# EAGLE design maplebacon (EAGLE 5.11)
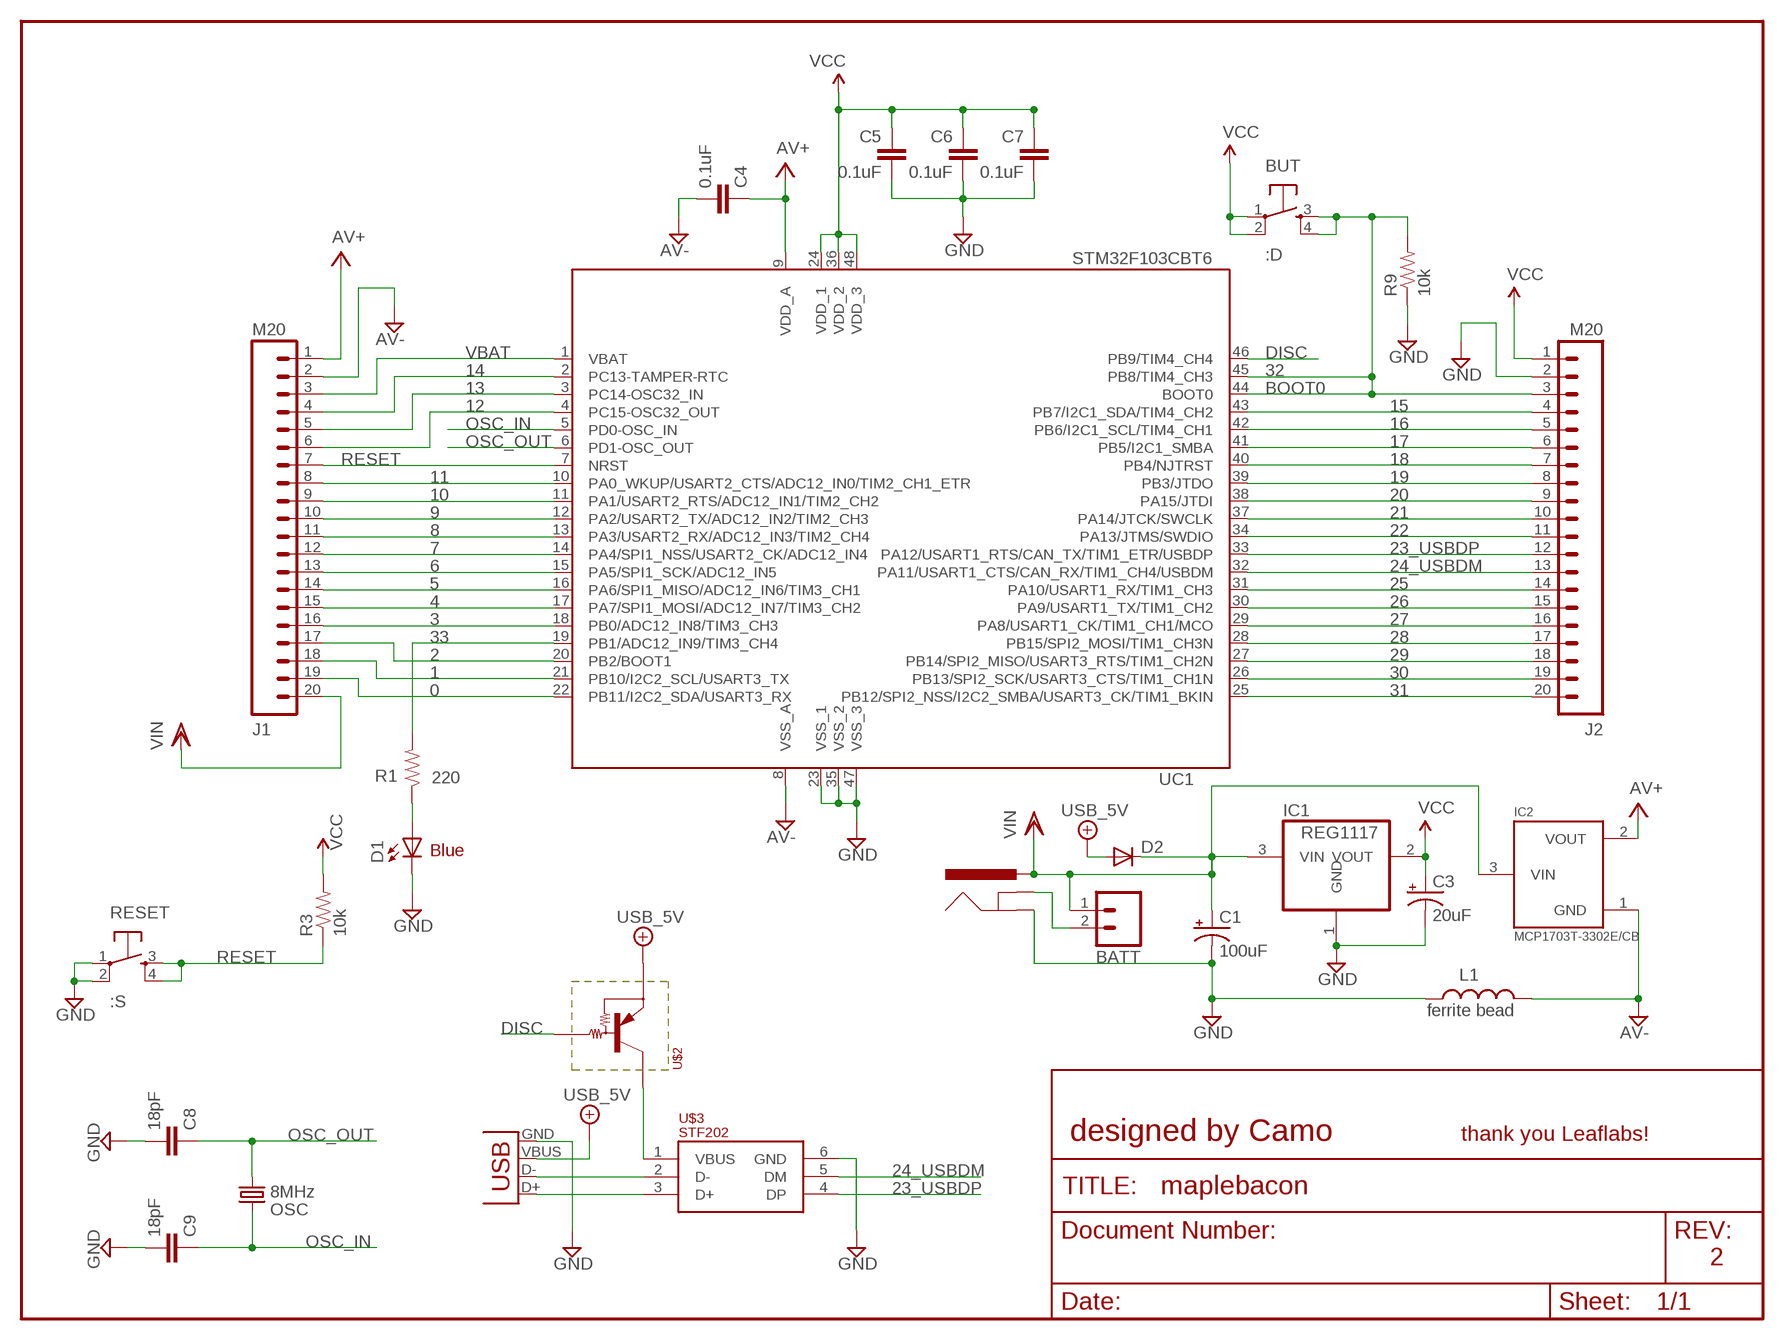
[diagram p0: schematic, sheet 1]

## Parts
BATT  M02  [02P]
BUT  :D  TAC_SWITCHPTH  [TACTILE-PTH]
C1  100uF  CAP_POLPTH2  [CPOL-RADIAL-10UF-25V]
C3  20uF  CAP_POLPTH2  [CPOL-RADIAL-10UF-25V]
C4  0.1uF  CAP0603  [0603]
C5  0.1uF  CAP0603  [0603]
C6  0.1uF  CAP0603  [0603]
C7  0.1uF  CAP0603  [0603]
C8  18pF  CAP0603  [0603]
C9  18pF  CAP0603  [0603]
D1  Blue  LED3MM  [LED3MM]
D2  DIODE1N4148  [DIODE-1N4148]
IC1  REG1117  [SOT223]
IC2  MCP1703T-3302E/CB  MCP1700T  [SOT23]
J1  M20  [1X20]
J2  M20  [1X20]
J3  POWER_JACKPTH  [POWER_JACK_PTH]
L1  ferrite bead  INDUCTOR0603  [0603]
OSC  8MHz  CRYSTALSMD  [HC49UP]
R1  220  RESISTOR0603  [0603]
R3  10k  RESISTOR0603  [0603]
R9  10k  RESISTOR0603  [0603]
RESET  :S  TAC_SWITCHPTH  [TACTILE-PTH]
U$2  PDTA114E  [SOT23]
U$3  STF202  [SOT23-6L]
UC1  STM32F103CBT6  STM32F103CB  [LQFP48]
USB-B  USB-MINIB  USBPTH  [USB-B-PTH]

## Nets
0: J1.19 UC1.22(PB11/I2C2_SDA/USART3_RX)
1: J1.18 UC1.21(PB10/I2C2_SCL/USART3_TX)
2: J1.17 UC1.20(PB2/BOOT1)
3: J1.16 UC1.18(PB0/ADC12_IN8/TIM3_CH3)
4: J1.15 UC1.17(PA7/SPI1_MOSI/ADC12_IN7/TIM3_CH2)
5: J1.14 UC1.16(PA6/SPI1_MISO/ADC12_IN6/TIM3_CH1)
6: J1.13 UC1.15(PA5/SPI1_SCK/ADC12_IN5)
7: J1.12 UC1.14(PA4/SPI1_NSS/USART2_CK/ADC12_IN4)
8: J1.11 UC1.13(PA3/USART2_RX/ADC12_IN3/TIM2_CH4)
9: J1.10 UC1.12(PA2/USART2_TX/ADC12_IN2/TIM2_CH3)
10: J1.9 UC1.11(PA1/USART2_RTS/ADC12_IN1/TIM2_CH2)
11: J1.8 UC1.10(PA0_WKUP/USART2_CTS/ADC12_IN0/TIM2_CH1_ETR)
12: J1.6 UC1.4(PC15-OSC32_OUT)
13: J1.5 UC1.3(PC14-OSC32_IN)
14: J1.4 UC1.2(PC13-TAMPER-RTC)
15: J2.4 UC1.43(PB7/I2C1_SDA/TIM4_CH2)
16: J2.5 UC1.42(PB6/I2C1_SCL/TIM4_CH1)
17: J2.6 UC1.41(PB5/I2C1_SMBA)
18: J2.7 UC1.40(PB4/NJTRST)
19: J2.8 UC1.39(PB3/JTDO)
20: J2.9 UC1.38(PA15/JTDI)
21: J2.10 UC1.37(PA14/JTCK/SWCLK)
22: J2.11 UC1.34(PA13/JTMS/SWDIO)
23_USBDP: J2.12 U$3.4(DP) UC1.33(PA12/USART1_RTS/CAN_TX/TIM1_ETR/USBDP)
24_USBDM: J2.13 U$3.5(DM) UC1.32(PA11/USART1_CTS/CAN_RX/TIM1_CH4/USBDM)
25: J2.14 UC1.31(PA10/USART1_RX/TIM1_CH3)
26: J2.15 UC1.30(PA9/USART1_TX/TIM1_CH2)
27: J2.16 UC1.29(PA8/USART1_CK/TIM1_CH1/MCO)
28: J2.17 UC1.28(PB15/SPI2_MOSI/TIM1_CH3N)
29: J2.18 UC1.27(PB14/SPI2_MISO/USART3_RTS/TIM1_CH2N)
30: J2.19 UC1.26(PB13/SPI2_SCK/USART3_CTS/TIM1_CH1N)
31: J2.20 UC1.25(PB12/SPI2_NSS/I2C2_SMBA/USART3_CK/TIM1_BKIN)
32: BUT.3 BUT.4 J2.3 R9.2 UC1.44(BOOT0) UC1.45(PB8/TIM4_CH3)
33: R1.2 UC1.19(PB1/ADC12_IN9/TIM3_CH4)
+5V/2: D2.A U$2.2(C) USB-B.VBUS ; supply symbol labelled USB_5V
AV+: C4.1 IC2.2(VOUT) J1.1 UC1.9(VDD_A)
AV-: C4.2 IC2.1(GND) J1.2 L1.1 UC1.8(VSS_A)
DGND: C1.2(-) C3.2(-) C5.2 C6.2 C7.2 C8.2 C9.2 D1.K(C) IC1.1(GND) J2.2 J3.GND L1.2 R9.1 RESET.1 RESET.2 U$3.6(GND) UC1.23(VSS_1) UC1.35(VSS_2) UC1.47(VSS_3) USB-B.GND ; supply symbol labelled GND
DISC: U$2.1(B) UC1.46(PB9/TIM4_CH4)
N$1: BATT.2 J3.GNDBREAK
N$2: D1.A R1.1
N$5: U$2.3(E) U$3.1(VBUS)
N$59: U$3.2(D-) USB-B.D-
N$60: U$3.3(D+) USB-B.D+
OSC_IN: C9.1 OSC.2 UC1.5(PD0-OSC_IN)
OSC_OUT: C8.1 OSC.1 UC1.6(PD1-OSC_OUT)
RESET: J1.7 R3.1 RESET.3 RESET.4 UC1.7(NRST)
VBAT: J1.3 UC1.1(VBAT)
VCC: BUT.1 BUT.2 C3.1(+) C5.1 C6.1 C7.1 IC1.2(VOUT) J2.1 R3.2 UC1.24(VDD_1) UC1.36(VDD_2) UC1.48(VDD_3)
VIN: BATT.1 C1.1(+) D2.C IC1.3(VIN) IC2.3(VIN) J1.20 J3.PWR

## Notes on the sheet
- BOOT0
- Blue
- designed by Camo | thank you Leaflabs!
- 2

## Library data of the parts
BATT = con-amp-quick:M02: AMP QUICK CONNECTOR; OC_FARNELL: unknown; OC_NEWARK: unknown
BUT RESET = 3d2011:TAC_SWITCH: Momentary Switch Button commonly used for reset or general input. Spark Fun Electronics SKU : COM-00097
C1 C3 = SparkFun3:CAP_POL: Capacitor Polarized These are standard SMD and PTH capacitors. Normally 10uF, 47uF, and 100uF in electrolytic and tantalum varieties. Always verify the external diameter of the through hole cap, it varies with capacity, voltage, and manufacturer. The EIA devices should be standard.
C4-C9 = SparkFun:CAP: Capacitor Standard 0603 ceramic capacitor, and 0.1" leaded capacitor.
D1 = SparkFun:LED: LEDs Standard schematic elements and footprints for 5mm, 3mm, 1206, and 0603 sized LEDs. 5mm - Spark Fun Electronics SKU : COM-00529 (and others)
D2 = SparkFun3:DIODE: Diode These are standard reverse protection diodes and small signal diodes. SMA package can handle up to about 1A. SOD-323 can handle about 200mA. What the SOD-323 package when ordering, there are some mfgs out there that are 5-pin packages.
IC1 = burr-brown:REG1117: 800mA and 1A Low Dropout (LDO) Positive Regulator 1.8V, 2.5V, 2.85V, 3.3V, 5V, and Adj; MPN: REG1117; OC_FARNELL: 1097566; OC_NEWARK: 14P6981
IC2 = okie:MCP1700T
J1 J2 = SparkFun3:M20: This is just like the LOCK variant in that the holes are staggared by 5 mil, but except for the last two holes. They are not altered from the "standard" footprint layout. This is used for a special purpose on the layout of our Graphic LCD Backpack. Make sure you want to use this device before selecting it for you project!
J3 = 3d2011:POWER_JACK: Power Jack This is the standard 5.5mm barrel jack for power. The PTH is the most common, proven, reliable, footprint. All others are experimental. The Slot footprint only works if the mill layer is transmitted to the PCB fab house so be warned. Spark Fun Electronics SKU : PRT-00119. Mating wall wart : TOL-00298 (and others)
L1 = SparkFun3:INDUCTOR: Inductors Basic Inductor/Choke - 0603 and 1206. Footprints are not proven and vary greatly between part numbers.
OSC = SparkFun2:CRYSTAL: Crystals Various standard crystals. Proven footprints. Spark Fun Electronics SKU : COM-00534
R1 R3 R9 = SparkFun:RESISTOR: Resistor Basic schematic elements and footprints for 0603, 1206, and PTH 1/10th watt (small) resistors.
U$2 = bacon:PDTA114E: Transistor with matching resistors (pre biased). Digikey #568-8088-1-ND
U$3 = bacon:STF202: The STF202 is a combination EMI filter and line termination device with integrated TVS diodes for use on upstream USB ports. Digikey Part #STF202-22T1GOSCT-ND
UC1 = stm32:STM32F103CB
USB-B = SparkFun2:USB: USB Connectors USB-B-PTH is fully proven SKU : PRT-00139 USB-miniB is fully proven SKU : PRT-00587 USB-A-PCB is untested. USB-A-H is throughly reviewed, but untested. Spark Fun Electronics SKU : PRT-00437 USB-B-SMT is throughly reviewed, but untested. Needs silkscreen touching up. USB-A-S has not been used/tested USB-MB-H has not been used/tested

## Net classes
1 vcc: width 0.254 mm

## Board
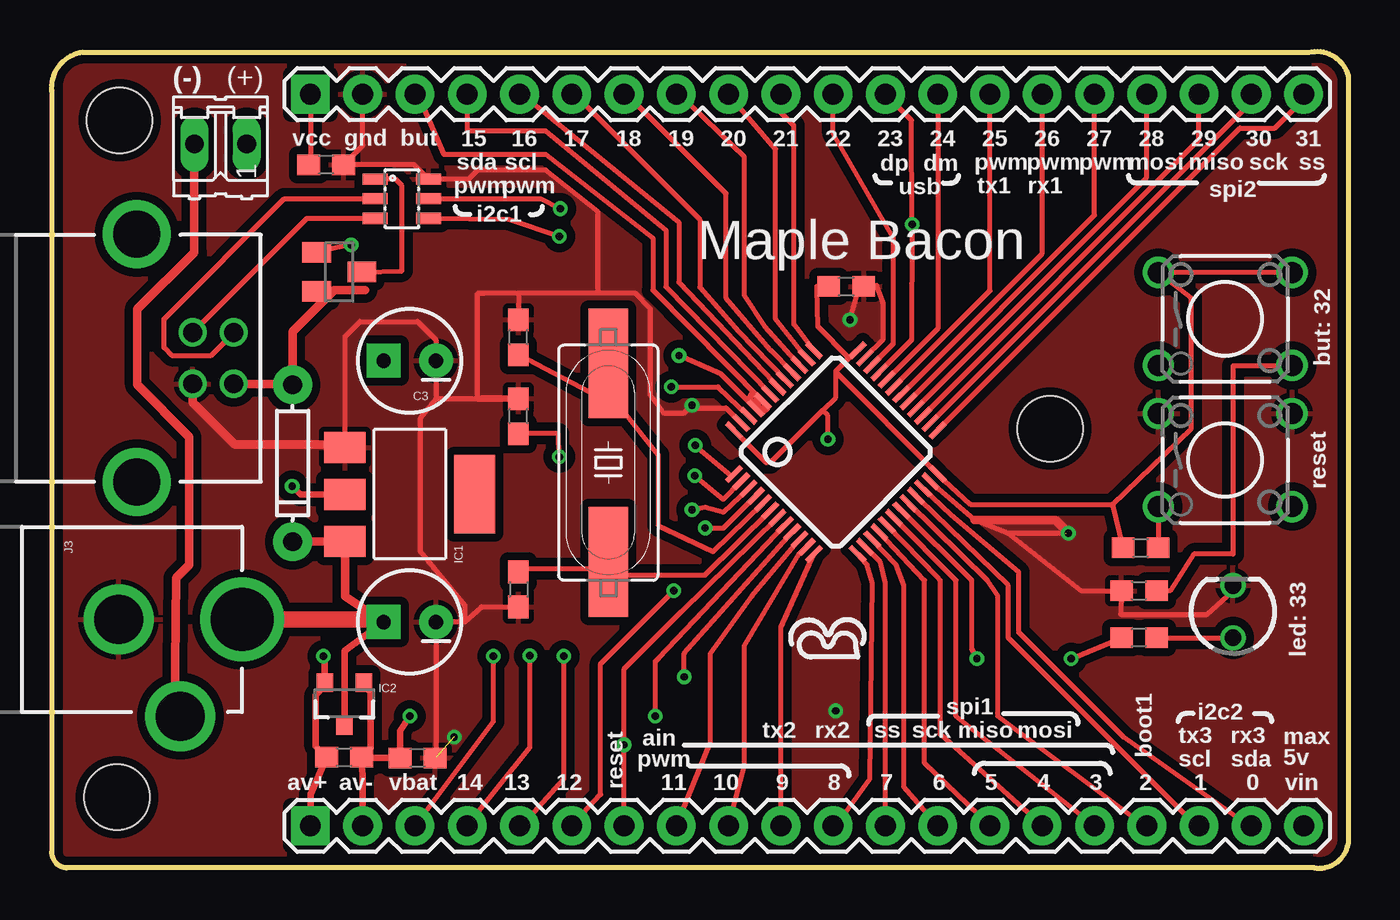
[diagram p1: board, top side]
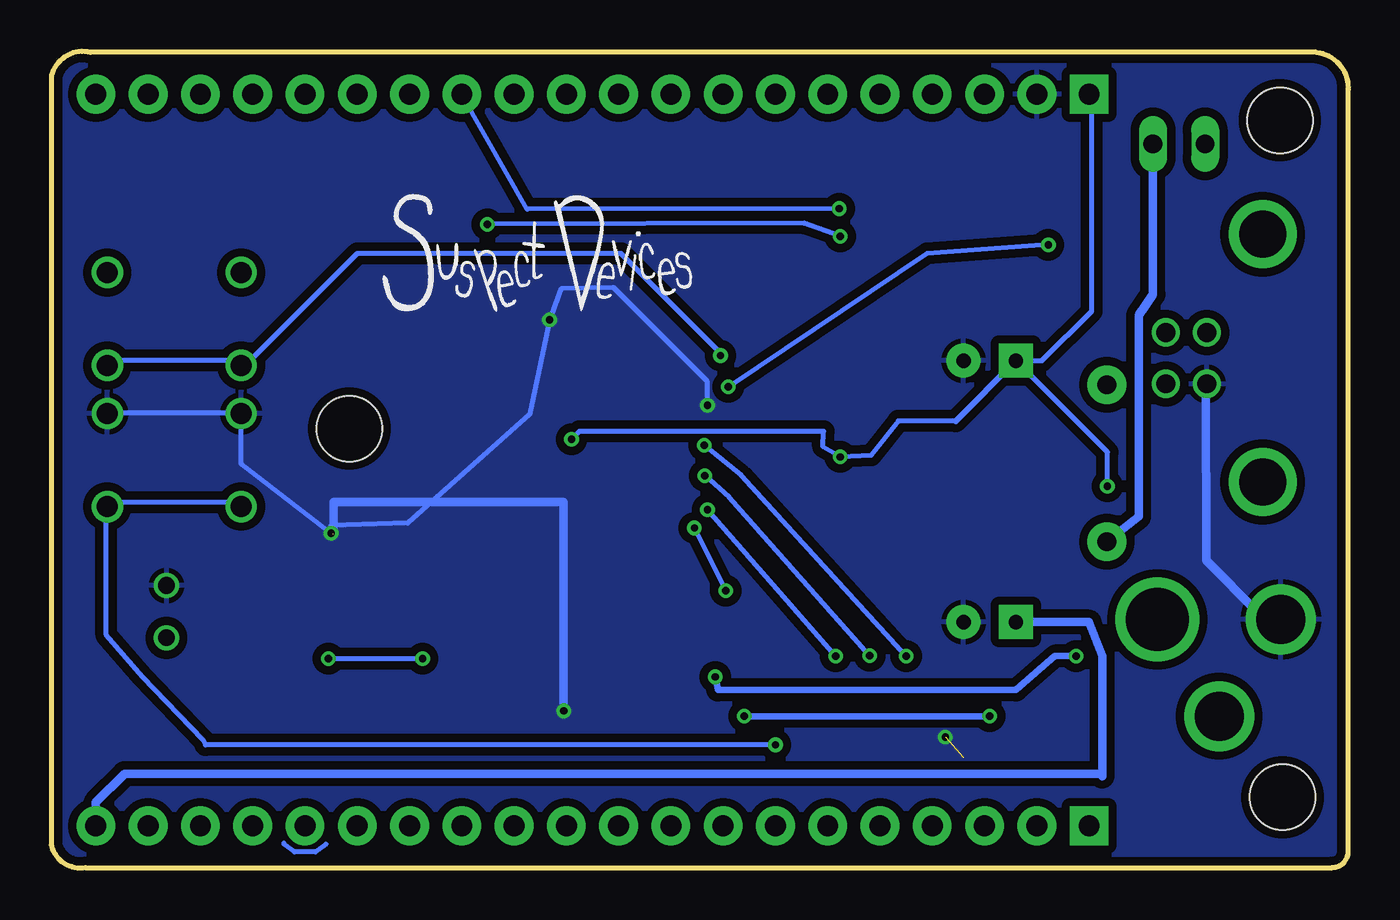
[diagram p2: board, bottom side, seen from below]

Size 63 x 39.69 mm. Coordinates in mm from the lower left corner, seen from the top.
Outline: 1.53,39.65 61.1,39.65 arc-90 63,38.5 63,1.17 arc-90 61.35,0.02 0.77,0.02 arc-90 0.01,0.78 0.01,37.74 arc-90 1.53,39.65
Copper layers (1*16): Top 0.0356mm / dielectric 1.5011mm / Bottom 0.0356mm
Design rules "LaenPCBOrder": minimum track width 6mil, minimum drill 13mil, track to track 6mil, track to pad 6mil, pad to pad 6mil, via to via 6mil, smd to smd 6mil, copper to edge 15mil, drill to drill 6mil, minimum pad ring 7mil, minimum via ring 7mil, stop-mask expansion 4mil, vias tented up to drill 0mil, thermal gap 10mil
Holes 3.17 mm at 3.31,36.34 3.19,3.45 48.52,21.36

### Footprints (pad centres in the part's own frame; a part is rotated, then mirrored left to right if it is on the bottom)
02P = drill 0.914 long: 1 -1.27,0; 2 1.27,0
TACTILE-PTH = drill 1.016 round: 1 -3.251,2.261; 2 3.251,2.261; 3 -3.251,-2.261; 4 3.251,-2.261
CPOL-RADIAL-10UF-25V = drill 0.7 pad 1.651 square: 1 1.27,0 | drill 0.7 pad 1.651 round: 2 -1.27,0
0603 = smd 1.1 x 1: 1 -0.85,0; 2 0.85,0
LED3MM = drill 0.813 round: A -1.27,0; K 1.27,0
DIODE-1N4148 = drill 0.9 pad 1.88 round: A -3.81,0; C 3.81,0
SOT223 = smd 1.499 x 2.007: 1 -2.261,-3.15; 2 0.025,-3.15; 3 2.311,-3.15 | smd 3.81 x 2.007: 4 0,3.15
SOT23 = smd 0.8 x 0.9: 1 -0.95,-1; 2 0.95,-1; 3 0,1.1
1X20 = drill 1.016 pad 1.88 square: 1 0,0 | drill 1.016 pad 1.88 round: 2 2.54,0; 3 5.08,0; 4 7.62,0; 5 10.16,0; 6 12.7,0; 7 15.24,0; 8 17.78,0; 9 20.32,0; 10 22.86,0; 11 25.4,0; 12 27.94,0; 13 30.48,0; 14 33.02,0; 15 35.56,0; 16 38.1,0; 17 40.64,0; 18 43.18,0; 19 45.72,0; 20 48.26,0
POWER_JACK_PTH = drill 2.381 round: GND 0,7.7; GNDBREAK 4.7,10.7 | drill 3.048 round: PWR 0,13.7
HC49UP = smd 5.334 x 1.93: 1 -4.826,0; 2 4.826,0
SOT23' = smd 1 x 1.4: 1 -0.95,-1.1; 2 0.95,-1.1; 3 0,1.1
SOT23-6L = smd 0.55 x 1.2: 1 -0.95,-1.3; 2 0,-1.3; 3 0.95,-1.3; 4 0.95,1.3; 5 0,1.3; 6 -0.95,1.3
LQFP48 = smd 0.254 x 1: 1 -2.75,-4.25; 2 -2.25,-4.25; 3 -1.75,-4.25; 4 -1.25,-4.25; 5 -0.75,-4.25; 6 -0.25,-4.25; 7 0.25,-4.25; 8 0.75,-4.25; 9 1.25,-4.25; 10 1.75,-4.25; 11 2.25,-4.25; 12 2.75,-4.25; 25 2.75,4.25; 26 2.25,4.25; 27 1.75,4.25; 28 1.25,4.25; 29 0.75,4.25; 30 0.25,4.25; 31 -0.25,4.25; 32 -0.75,4.25; 33 -1.25,4.25; 34 -1.75,4.25; 35 -2.25,4.25; 36 -2.75,4.25 | smd 1 x 0.254: 13 4.25,-2.75; 14 4.25,-2.25; 15 4.25,-1.75; 16 4.25,-1.25; 17 4.25,-0.75; 18 4.25,-0.25; 19 4.25,0.25; 20 4.25,0.75; 21 4.25,1.25; 22 4.25,1.75; 23 4.25,2.25; 24 4.25,2.75; 37 -4.25,2.75; 38 -4.25,2.25; 39 -4.25,1.75; 40 -4.25,1.25; 41 -4.25,0.75; 42 -4.25,0.25; 43 -4.25,-0.25; 44 -4.25,-0.75; 45 -4.25,-1.25; 46 -4.25,-1.75; 47 -4.25,-2.25; 48 -4.25,-2.75
USB-B-PTH = drill 0.914 round: D+ 0,1.25; D- 1.981,1.25; GND 0,-1.25; VBUS 1.981,-1.25 | drill 2.286 round: P$1 -2.718,-6.02; P$2 -2.718,6.02

### Placement (x,y rotation side)
BATT  8.21,35.2 180 top
BUT  57.03,26.69 0 top
C1  17.41,11.96 180 top
C3  17.41,24.66 180 top
C4  14.22,5.39 0 top
C5  22.69,21.97 90 top
C6  13.35,34.19 0 top
C7  38.62,28.27 0 top
C8  22.69,13.55 270 top
C9  22.69,25.8 90 top
D1  57.41,12.47 90 top
D2  11.72,19.68 270 top
IC1  17.41,18.18 270 top
IC2  14.23,8.02 180 top
J1  12.58,2.05 0 top
J2  12.58,37.61 0 top
J3  -4.43,12.09 270 top
L1  17.79,5.36 0 top
OSC  27.06,19.71 90 top
R1  52.84,11.2 180 top
R3  52.92,15.57 180 top
R9  52.84,13.48 0 top
RESET  57.03,19.83 0 top
U$1  [SUSDEVLOGOSM]  47,27.33 0 bottom
U$2  PDTA114E  [SOT23']  13.98,28.98 270 top
U$3  17.03,32.53 270 top
UC1  38.11,20.22 315 top
USB-B  6.87,24.79 0 top

### Tracks (layer width: path | path; a pad name or v marks a point on that pad's centre or on a via)
0
  Top 0.254: UC1.22 43.7,17.17 47,14.37 47,11.45 52.08,6.37 58.18,2.05 J1.19
1
  Top 0.254: UC1.21 42.17,17.93 46.49,13.74 46.49,11.2 55.64,2.05 J1.18
2
  Top 0.254: UC1.20 45.48,13.99 45.98,13.23 45.98,7.39 53.1,2.05 J1.17
3
  Top 0.254: J1.16 43.95,7.39 43.95,13.99 40.9,17.04 UC1.18
4
  Top 0.254: J1.15 43.19,6.5 43.19,13.99 43.06,14.12 UC1.17
5
  Top 0.254: J1.14 42.43,5.1 42.43,13.99 UC1.16
6
  Top 0.254: J1.13 41.41,3.96 41.41,13.74 41.03,14.75 UC1.15
7
  Top 0.254: J1.12 40.52,13.87 40.27,14.88 39.38,15.77 UC1.14
8
  Top 0.254: UC1.13 39.63,14.75 39.89,13.87 39.76,4.34 38.11,2.05 J1.11
9
  Top 0.254: J1.10 35.44,11.71 UC1.12
10
  Top 0.254: UC1.11 36.33,15.26 33.67,10.82 33.67,4.98 J1.9
11
  Top 0.254: UC1.10 34.05,13.23 32.01,10.44 32.01,6.12 J1.8
12  (via drill 0.36)
  Top 0.254: v31.76,16.53 32.65,16.53 UC1.4 | v30.24,13.48 26.68,9.93 26.68,3.58 J1.6
  Bottom 0.254: v30.24,13.48 v31.76,16.53
13  (via drill 0.36)
  Top 0.254: v24.9,10.31 24.9,4.34 22.87,2.05 J1.5 | v31.13,17.42 31.76,17.55 32.65,17.3 UC1.3
  Bottom 0.254: v24.9,10.31 v31.13,17.42
14  (via drill 0.36)
  Top 0.254: v31.25,19.07 32.65,17.93 UC1.2 | v23.25,10.33 23.25,5.86 J1.4
  Bottom 0.254: v31.25,19.07 30.06,18.01 v23.25,10.33
15
  Top 0.254: UC1.43 29.86,28.24 29.86,31.01 24.01,35.84 20.2,35.84 J2.4
16
  Top 0.254: UC1.42 35.06,23.64 30.49,28.47 30.49,31.39 22.87,37.61 J2.5
17
  Top 0.254: UC1.41 33.41,26.06 31.51,28.22 31.51,31.52 25.41,37.61 J2.6
18
  Top 0.254: UC1.40 34.94,25.17 32.78,27.71 32.78,32.79 27.95,37.61 J2.7
19
  Top 0.254: UC1.39 34.68,26.31 33.67,27.84 33.67,34.57 30.49,37.61 J2.8
20
  Top 0.254: UC1.38 36.59,24.91 35.19,26.69 35.19,34.95 J2.9
21
  Top 0.254: UC1.37 36.08,26.44 36.08,36.09 35.44,36.73 J2.10
22
  Top 0.254: UC1.34 40.9,25.48 40.9,30.63 37.98,35.71 J2.11
23_USBDP  (via drill 0.36)
  Top 0.254: U$3.4 22.2,31.53 v24.67,30.71 | J2.12 41.79,36.34 v41.82,31.29 41.79,25.68 UC1.33
  Bottom 0.254: v24.67,30.71 26.43,31.34 v41.82,31.29
24_USBDM  (via drill 0.36)
  Top 0.254: UC1.32 43.06,26.23 J2.13 | U$3.5 23.76,32.53 v24.72,32.05
  Bottom 0.254: v24.72,32.05 39.89,32.03 J2.13
25
  Top 0.254: UC1.31 45.6,28.06 J2.14
26
  Top 0.254: UC1.30 41.16,22.88 48.14,29.87 J2.15
27
  Top 0.254: UC1.29 50.68,31.73 J2.16
28
  Top 0.254: UC1.28 53.22,33.56 J2.17
29
  Top 0.254: UC1.27 55.76,35.39 J2.18
30
  Top 0.254: UC1.26 58.3,37.23 J2.19
31
  Top 0.254: UC1.25 57.75,35.96 59.45,35.96 60.84,37.36 J2.20
32  (via drill 0.36)
  Top 0.254: J2.3 17.79,37.61 19.06,34.69 24.01,34.69 29.22,30.63 29.22,28.09 UC1.44 34.55,22.63 34.43,22.63 34.05,23.14 33.92,22.88 34.55,22.12 34.81,22.37 34.3,22.37 UC1.45 32.52,24.03 v30.49,24.91 | R9.2 54.37,13.48 55.51,15.26 57.41,15.26 57.41,24.41 60.26,24.41 BUT.4
  Bottom 0.254: BUT.4 60.21,24.66 53.86,24.66 BUT.3 53.6,24.41 48.14,29.87 35.32,29.87 30.49,25.04 v30.49,24.91
33  (via drill 0.36)
  Top 0.254: UC1.19 44.71,13.99 44.71,10.69 v44.97,10.18 | v49.54,10.18 R1.2
  Bottom 0.254: v44.97,10.18 v49.54,10.18
+5V/2
  Top 0.254: 11.67,23.54 D2.A | 15.23,28.09 U$2.2
  Top 0.406: USB-B.VBUS 11.67,23.54 | D2.A 11.72,26.08 13.73,28.09 15.23,28.09
AV+  (via drill 0.36)
  Top 0.254: UC1.9 30.74,10.44 v30.74,9.29 | 13.28,8.85 IC2.2 | 13.28,10.24 v13.22,10.31
  Top 0.305: J1.1 12.58,3.59 C4.1 12.84,5.93 12.84,8.4 13.28,8.85 | IC2.2 13.28,10.24
  Bottom 0.305: v13.22,10.31 14.23,10.31 16.14,8.66 30.62,8.66 v30.74,9.29
AV-  (via drill 0.36)
  Top 0.254: 29.49,10.2 29.35,10.06 | 29.49,10.2 UC1.8 | 15.18,8.85 IC2.1 | 15.5,5.83 C4.2 15.11,5.36 | v29.35,7.39 29.35,10.06 29.49,10.2
  Top 0.305: J1.2 15.12,4.43 C4.2 | 15.18,8.85 15.5,8.53 15.5,5.83 | 15.11,5.36 L1.1 16.94,6.67 v17.41,7.39
  Bottom 0.305: v17.41,7.39 v29.35,7.39
DGND  (via drill 0.36)  (2 unrouted)
  Top 0.254: D1.K 57.41,13.48 56.14,12.34 51.95,12.34 R9.1 50.05,13.48 46.49,16.28 | 46.49,16.28 44.84,16.91 42.94,18.56 UC1.23 | UC1.47 32.77,22.37 31.25,22.37 v31.13,22.5 30.74,22.12 29.73,22.12 29.09,23.01 29.09,27.2 28.33,27.96 26.55,27.96 | 22.69,27.96 C9.2 | C8.2 20.89,12.7 20.08,11.96 | J2.2 15.12,35.11 C6.2 17.63,34.19 U$3.6 20.26,33.48 20.71,33.93 24.01,33.93 26.55,31.9 26.55,27.96 | v49.41,16.28 46.49,16.28 | UC1.35 39.53,24.81 40.4,25.68 40.4,27.45 40.09,28.32 | 40.09,28.32 39.71,28.01 C7.2 | 40.09,28.32 39.25,28.27 v38.8,26.64 | 22.69,27.96 26.55,27.96 | 18.68,22.83 C3.2 18.68,25.68 17.79,26.57 15,26.57 14.26,25.83 IC1.1 14.11,20.6 | 18.68,22.83 20.71,22.83 20.71,27.94 21.02,27.94 22.69,27.96 | 20.08,11.96 20.08,12.77 17.92,15.39 17.92,21.87 18.68,22.83 | 9.28,20.6 9.27,20.58 | 20.08,11.96 C1.2 18.68,5.4 L1.2
  Top 0.305: C5.2 20.71,22.82 20.71,22.83
  Top 0.406: USB-B.GND 6.87,22.63 8.9,20.6 9.28,20.6 14.11,20.6 | 44.84,16.91 48.78,16.91 49.39,16.3 49.26,16.3 | 49.26,16.3 49.18,16.3 | 49.26,16.3 49.31,16.25 49.39,16.25
  Bottom 0.254: RESET.2 60.21,22.12 53.86,22.12 RESET.1 53.78,19.63 v49.41,16.28 49.43,16.65 45.68,16.77 39.76,22.05 v38.8,26.64 38.24,28.17 35.7,28.22 31.13,23.64 v31.13,22.5
  Bottom 0.406: v38.11,7.64 38.11,17.8 49.29,17.8 49.29,16.28 | J3.GND 4.33,12.39 6.89,14.96 6.92,23.49 USB-B.GND
  other vias: 19.57,6.37
  pour Top (isolate 0.406, rank 2): 0.14,40.54 63,40.54 63,-0.49 -0.62,-0.36 -0.62,39.77
  pour Bottom (isolate 0.406): 0.01,40.41 63.38,40.28 63.13,-0.87 -0.37,-0.74 -0.24,40.03
DISC  (via drill 0.36)
  Top 0.254: v30.11,23.39 32.4,23.39 UC1.46 | v14.56,30.3 U$2.1
  Bottom 0.254: v30.11,23.39 20.46,29.87 v14.56,30.3
GND
  Bottom 0.254: 49.67,1.18 49.67,1.17 50.18,0.78 51.19,0.78 51.7,1.17 51.7,1.22
N$1
  Top 0.406: BATT.2 6.94,29.92 4.18,27.18 4.18,23.49 6.69,20.95 6.69,14.73 6.06,14.09 5.98,7.81 J3.GNDBREAK
N$2
  Top 0.254: R1.1 D1.A
N$5
  Top 0.254: U$3.1 16.71,33.48 17.03,33.17 17.03,29.02 U$2.3
N$59
  Top 0.254: USB-B.D- 8.85,26.01 7.76,24.91 5.85,24.91 5.47,25.3 5.47,26.69 11.31,32.53 U$3.2
N$60
  Top 0.254: U$3.3 12.42,31.58 USB-B.D+
OSC_IN
  Top 0.254: UC1.5 32.14,15.39 29.47,16.66 29.47,20.09 27.25,22.9 | 27.25,22.9 27.06,23.14 OSC.2 | C9.1 27.01,22.67 27.25,22.9
OSC_OUT
  Top 0.254: UC1.6 31.76,14.25 27.06,14.25 OSC.1 26.25,14.58 22.95,14.58 C8.1
RESET  (via drill 0.36)
  Top 0.254: R3.1 53.78,15.58 RESET.3 | J1.7 v27.82,5.99 27.82,9.67 30.62,12.47 UC1.7
  Bottom 0.254: RESET.3 53.86,17.8 60.21,17.8 RESET.4 60.34,17.52 60.34,11.33 58.56,9.29 55.64,6.25 55.51,5.99 v27.82,5.99
VBAT  (via drill 0.36)
  Top 0.254: v31.28,20.55 33.03,19.07 UC1.1 | v21.47,10.31 21.47,7.13 J1.3
  Bottom 0.254: v31.28,20.55 29.47,19.07 v21.47,10.31
VCC  (via drill 0.36)
  Top 0.254: BUT.2 60.21,28.98 53.86,28.98 BUT.1 55.38,27.71 55.38,21.36 51.54,17.68 | 51.54,17.68 R3.2 | 51.54,17.68 44.66,17.68 UC1.24 38.11,24.1 | UC1.48 34.73,19.71 34.94,19.71 37.48,22.25 | 37.48,22.25 38.11,22.88 38.11,24.1 | 38.75,24.79 38.11,24.15 38.11,24.1 | 38.75,24.79 39.12,25.17 UC1.36 | C7.1 37.2,28.27 37.2,28.17 37.24,26.32 38.75,24.79 | C5.1 24.64,21.12 v24.67,19.99 | v37.73,20.85 37.73,21.99 37.48,22.25 | J2.1 12.58,34.27 C6.1
  Top 0.305: IC1.2 12.1,18.16 v11.69,18.56
  Bottom 0.254: v37.73,20.85 37.35,21.23 25.49,21.23 25.51,20.47 v24.67,19.99 23.18,20.06 21.85,21.74 19.06,21.74 | J2.1 12.46,37.49 12.46,27.07 14.87,24.66 C3.1 11.69,20.22 v11.69,18.56
  Bottom 0.305: C3.1 19.06,21.74
VIN
  Top 0.305: IC2.3 14.23,10.56 C1.1
  Top 0.406: D2.C IC1.3 14.26,13.21 C1.1
  Top 0.813: J3.PWR 16.14,12.09 C1.1
  Bottom 0.406: J1.20 60.84,3.2 59.45,4.59 11.95,4.59 | 11.95,4.59 11.95,10.31 12.58,11.96 C1.1 | 11.95,4.47 11.95,4.59 | BATT.1 9.48,27.89 10.17,26.87 10.17,17.09 D2.C

### Text on the board
tNames: (-) | (+) | vcc | gnd | but | 15 | 16 | 17 | 18 | 19 | 20 | 21 | 22 | 23 | dp | 24 | dm | 25 | 26 | 27 | 28 | 29 | 30 | 31 | sda | scl | usb | pwm | pwm | pwm | mosi | miso | sck | ss | pwm | pwm | tx1 | rx1 | spi2 | i2c1 | Maple Bacon | but: 32 | reset | led: 33 | boot1 | spi1 | i2c2 | ain | tx2 | rx2 | ss | sck | miso | mosi | tx3 | rx3 | max | pwm | scl | sda | 5v | av+ | av- | vbat | 14 | 13 | 12 | reset | 11 | 10 | 9 | 8 | 7 | 6 | 5 | 4 | 3 | 2 | 1 | 0 | vin